# EAGLE design BMS Adapter Segment (EAGLE 8.1.0)
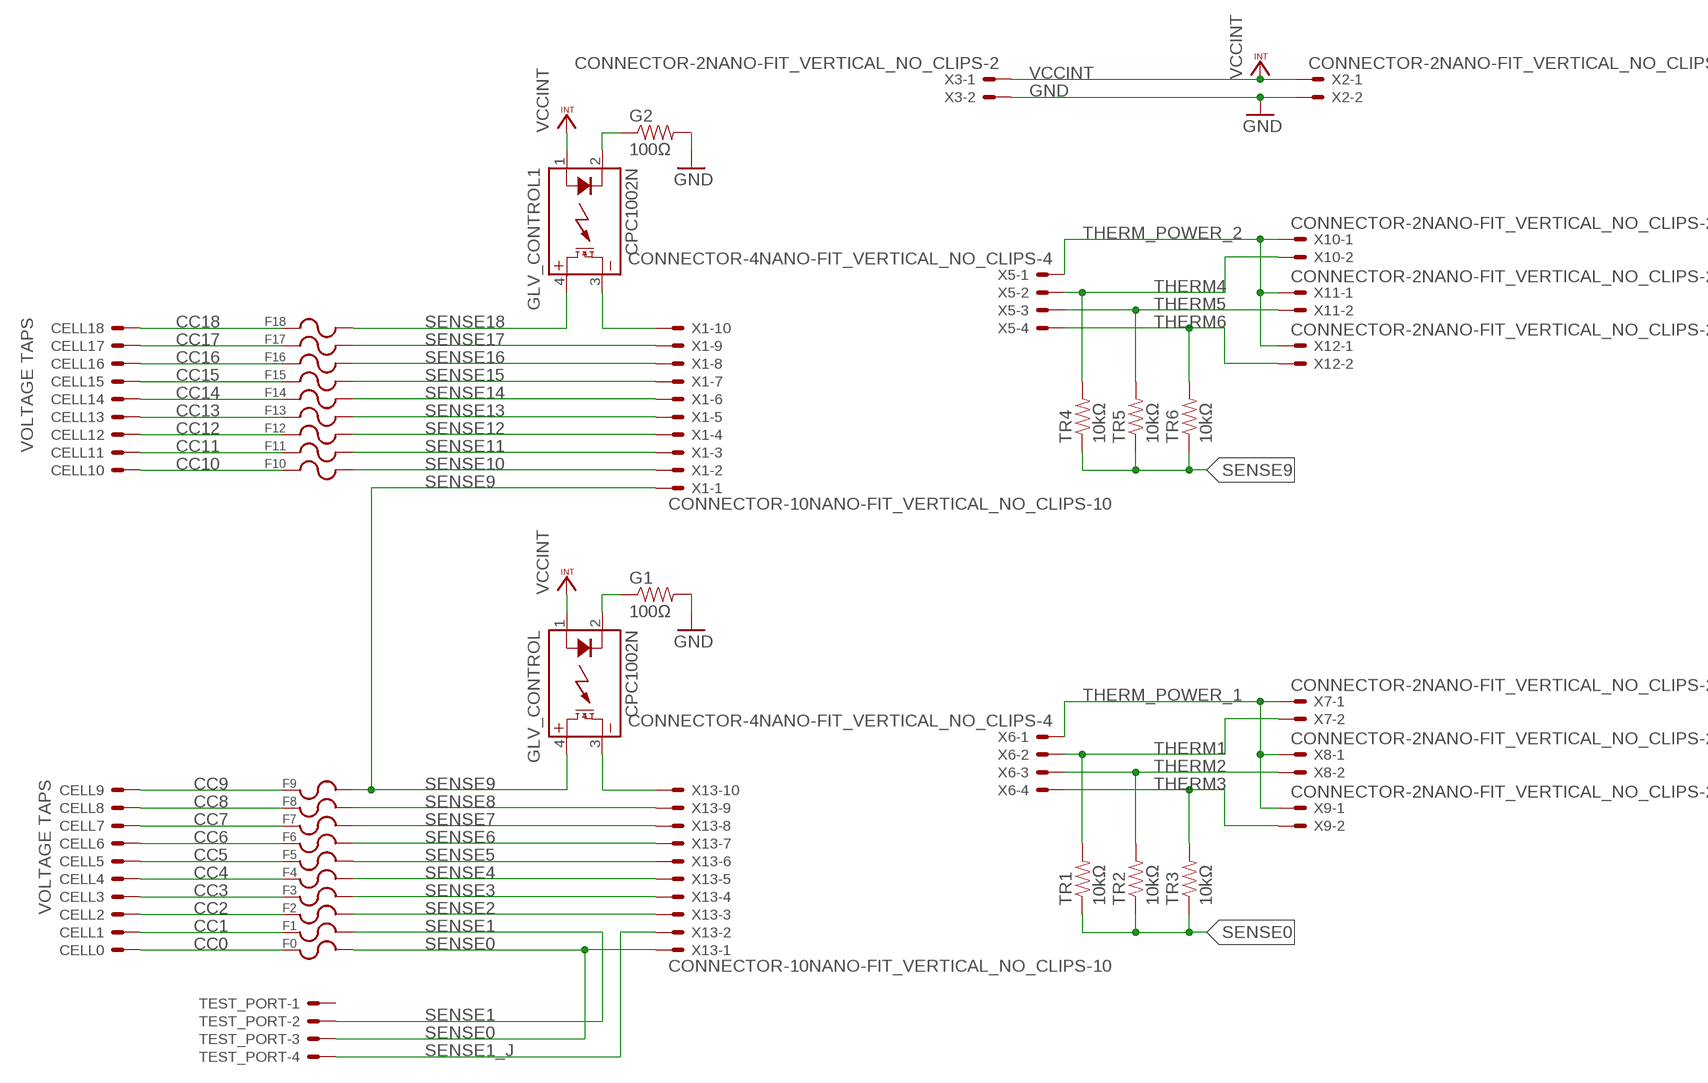
[diagram p0: schematic, sheet 1]

## Parts
CELL0  BATTERY_SPRING_KEYSTONE5222  [KEYSTONE5222]
CELL1  BATTERY_SPRING_KEYSTONE5222  [KEYSTONE5222]
CELL2  BATTERY_SPRING_KEYSTONE5222  [KEYSTONE5222]
CELL3  BATTERY_SPRING_KEYSTONE5222  [KEYSTONE5222]
CELL4  BATTERY_SPRING_KEYSTONE5222  [KEYSTONE5222]
CELL5  BATTERY_SPRING_KEYSTONE5222  [KEYSTONE5222]
CELL6  BATTERY_SPRING_KEYSTONE5222  [KEYSTONE5222]
CELL7  BATTERY_SPRING_KEYSTONE5222  [KEYSTONE5222]
CELL8  BATTERY_SPRING_KEYSTONE5222  [KEYSTONE5222]
CELL9  BATTERY_SPRING_KEYSTONE5222  [KEYSTONE5222]
CELL10  BATTERY_SPRING_KEYSTONE5222  [KEYSTONE5222]
CELL11  BATTERY_SPRING_KEYSTONE5222  [KEYSTONE5222]
CELL12  BATTERY_SPRING_KEYSTONE5222  [KEYSTONE5222]
CELL13  BATTERY_SPRING_KEYSTONE5222  [KEYSTONE5222]
CELL14  BATTERY_SPRING_KEYSTONE5222  [KEYSTONE5222]
CELL15  BATTERY_SPRING_KEYSTONE5222  [KEYSTONE5222]
CELL16  BATTERY_SPRING_KEYSTONE5222  [KEYSTONE5222]
CELL17  BATTERY_SPRING_KEYSTONE5222  [KEYSTONE5222]
CELL18  BATTERY_SPRING_KEYSTONE5222  [KEYSTONE5222]
F0  0751.0110_FUSE_CLIP  [0751.0110]
F1  0751.0110_FUSE_CLIP  [0751.0110]
F2  0751.0110_FUSE_CLIP  [0751.0110]
F3  0751.0110_FUSE_CLIP  [0751.0110]
F4  0751.0110_FUSE_CLIP  [0751.0110]
F5  0751.0110_FUSE_CLIP  [0751.0110]
F6  0751.0110_FUSE_CLIP  [0751.0110]
F7  0751.0110_FUSE_CLIP  [0751.0110]
F8  0751.0110_FUSE_CLIP  [0751.0110]
F9  0751.0110_FUSE_CLIP  [0751.0110]
F10  0751.0110_FUSE_CLIP  [0751.0110]
F11  0751.0110_FUSE_CLIP  [0751.0110]
F12  0751.0110_FUSE_CLIP  [0751.0110]
F13  0751.0110_FUSE_CLIP  [0751.0110]
F14  0751.0110_FUSE_CLIP  [0751.0110]
F15  0751.0110_FUSE_CLIP  [0751.0110]
F16  0751.0110_FUSE_CLIP  [0751.0110]
F17  0751.0110_FUSE_CLIP  [0751.0110]
F18  0751.0110_FUSE_CLIP  [0751.0110]
G1  100Ω  RESISTOR0805-RES  [0805]
G2  100Ω  RESISTOR0805-RES  [0805]
GLV_CONTROL  CPC1002N  [SOP04]
GLV_CONTROL1  CPC1002N  [SOP04]
TEST_PORT  MINIFIT_5566-4  [MINIFIT_5566-4]
TR1  10kΩ  RESISTOR0805-RES  [0805]
TR2  10kΩ  RESISTOR0805-RES  [0805]
TR3  10kΩ  RESISTOR0805-RES  [0805]
TR4  10kΩ  RESISTOR0805-RES  [0805]
TR5  10kΩ  RESISTOR0805-RES  [0805]
TR6  10kΩ  RESISTOR0805-RES  [0805]
X1  CONNECTOR-10NANO-FIT_VERTICAL_NO_CLIPS-10  [NANO-FIT_VERTICAL_NO_CLIPS-10]
X2  CONNECTOR-2NANO-FIT_VERTICAL_NO_CLIPS-2  [NANO-FIT_VERTICAL_NO_CLIPS-2]
X3  CONNECTOR-2NANO-FIT_VERTICAL_NO_CLIPS-2  [NANO-FIT_VERTICAL_NO_CLIPS-2]
X5  CONNECTOR-4NANO-FIT_VERTICAL_NO_CLIPS-4  [NANO-FIT_VERTICAL_NO_CLIPS-4]
X6  CONNECTOR-4NANO-FIT_VERTICAL_NO_CLIPS-4  [NANO-FIT_VERTICAL_NO_CLIPS-4]
X7  CONNECTOR-2NANO-FIT_VERTICAL_NO_CLIPS-2  [NANO-FIT_VERTICAL_NO_CLIPS-2]
X8  CONNECTOR-2NANO-FIT_VERTICAL_NO_CLIPS-2  [NANO-FIT_VERTICAL_NO_CLIPS-2]
X9  CONNECTOR-2NANO-FIT_VERTICAL_NO_CLIPS-2  [NANO-FIT_VERTICAL_NO_CLIPS-2]
X10  CONNECTOR-2NANO-FIT_VERTICAL_NO_CLIPS-2  [NANO-FIT_VERTICAL_NO_CLIPS-2]
X11  CONNECTOR-2NANO-FIT_VERTICAL_NO_CLIPS-2  [NANO-FIT_VERTICAL_NO_CLIPS-2]
X12  CONNECTOR-2NANO-FIT_VERTICAL_NO_CLIPS-2  [NANO-FIT_VERTICAL_NO_CLIPS-2]
X13  CONNECTOR-10NANO-FIT_VERTICAL_NO_CLIPS-10  [NANO-FIT_VERTICAL_NO_CLIPS-10]

## Nets
CC0: CELL0.P$1(S) F0.L1 F0.L2
CC1: CELL1.P$1(S) F1.L1 F1.L2
CC2: CELL2.P$1(S) F2.L1 F2.L2
CC3: CELL3.P$1(S) F3.L1 F3.L2
CC4: CELL4.P$1(S) F4.L1 F4.L2
CC5: CELL5.P$1(S) F5.L1 F5.L2
CC6: CELL6.P$1(S) F6.L1 F6.L2
CC7: CELL7.P$1(S) F7.L1 F7.L2
CC8: CELL8.P$1(S) F8.L1 F8.L2
CC9: CELL9.P$1(S) F9.L1 F9.L2
CC10: CELL10.P$1(S) F10.L1 F10.L2
CC11: CELL11.P$1(S) F11.L1 F11.L2
CC12: CELL12.P$1(S) F12.L1 F12.L2
CC13: CELL13.P$1(S) F13.L1 F13.L2
CC14: CELL14.P$1(S) F14.L1 F14.L2
CC15: CELL15.P$1(S) F15.L1 F15.L2
CC16: CELL16.P$1(S) F16.L1 F16.L2
CC17: CELL17.P$1(S) F17.L1 F17.L2
CC18: CELL18.P$1(S) F18.L1 F18.L2
GND: G1.2 G2.2 X2.P$2 X3.P$2
N$2: GLV_CONTROL1.3(DC-) X1.P$10
N$3: GLV_CONTROL.3(DC-) X13.P$10
SENSE0: F0.R1 F0.R2 TEST_PORT.3 TR1.1 TR2.1 TR3.1 X13.P$1
SENSE1: F1.R1 F1.R2 TEST_PORT.2
SENSE1_J: TEST_PORT.4 X13.P$2
SENSE2: F2.R1 F2.R2 X13.P$3
SENSE3: F3.R1 F3.R2 X13.P$4
SENSE4: F4.R1 F4.R2 X13.P$5
SENSE5: F5.R1 F5.R2 X13.P$6
SENSE6: F6.R1 F6.R2 X13.P$7
SENSE7: F7.R1 F7.R2 X13.P$8
SENSE8: F8.R1 F8.R2 X13.P$9
SENSE9: F9.R1 F9.R2 GLV_CONTROL.4(DC+) TR4.1 TR5.1 TR6.1 X1.P$1
SENSE10: F10.R1 F10.R2 X1.P$2
SENSE11: F11.R1 F11.R2 X1.P$3
SENSE12: F12.R1 F12.R2 X1.P$4
SENSE13: F13.R1 F13.R2 X1.P$5
SENSE14: F14.R1 F14.R2 X1.P$6
SENSE15: F15.R1 F15.R2 X1.P$7
SENSE16: F16.R1 F16.R2 X1.P$8
SENSE17: F17.R1 F17.R2 X1.P$9
SENSE18: F18.R1 F18.R2 GLV_CONTROL1.4(DC+)
SSR-: G1.1 GLV_CONTROL.2(CONTROL-)
SSR-1: G2.1 GLV_CONTROL1.2(CONTROL-)
THERM1: TR1.2 X6.P$2 X7.P$2
THERM2: TR2.2 X6.P$3 X8.P$2
THERM3: TR3.2 X6.P$4 X9.P$2
THERM4: TR4.2 X5.P$2 X10.P$2
THERM5: TR5.2 X5.P$3 X11.P$2
THERM6: TR6.2 X5.P$4 X12.P$2
THERM_POWER_1: X6.P$1 X7.P$1 X8.P$1 X9.P$1
THERM_POWER_2: X5.P$1 X10.P$1 X11.P$1 X12.P$1
VCCINT: GLV_CONTROL1.1(CONTROL+) GLV_CONTROL.1(CONTROL+) X2.P$1 X3.P$1
Unconnected: TEST_PORT.1

## Notes on the sheet
- VOLTAGE TAPS
- VOLTAGE TAPS

## Library data of the parts
CELL0 CELL1-CELL18 = HyTechDevices:BATTERY_SPRING
F0 F1-F18 = HyTechDevices:0751.0110_FUSE_CLIP: Schurter 0751.0110 Brass Fuse Clip Datasheet <http://www.mouser.com/ds/2/358/typ_OG__Clip__5x20-2553.pdf>
G1 G2 TR1-TR6 = HyTechDevices:RESISTOR: Resistor Basic schematic elements and footprints for 0603, 1206, and PTH resistors.
GLV_CONTROL GLV_CONTROL1 = HyTechDevices:CPC1002N: IXYS Solid State Relay .7A
TEST_PORT = HyTechDevices:MINIFIT_5566-4: Mini-Fit Junior connector 4 pole Source: http://www.molex.com; OC_FARNELL: unknown; OC_NEWARK: unknown
X1 X13 = HyTechDevices:CONNECTOR-10: Mini-Fit Junior connector 10 pole Source: http://www.molex.com
X2 X3 X7-X12 = HyTechDevices:CONNECTOR-2: Mini-Fit Junior connector 2 pole Source: http://www.molex.com
X5 X6 = HyTechDevices:CONNECTOR-4: Mini-Fit Junior connector 4 pole Source: http://www.molex.com

## Board
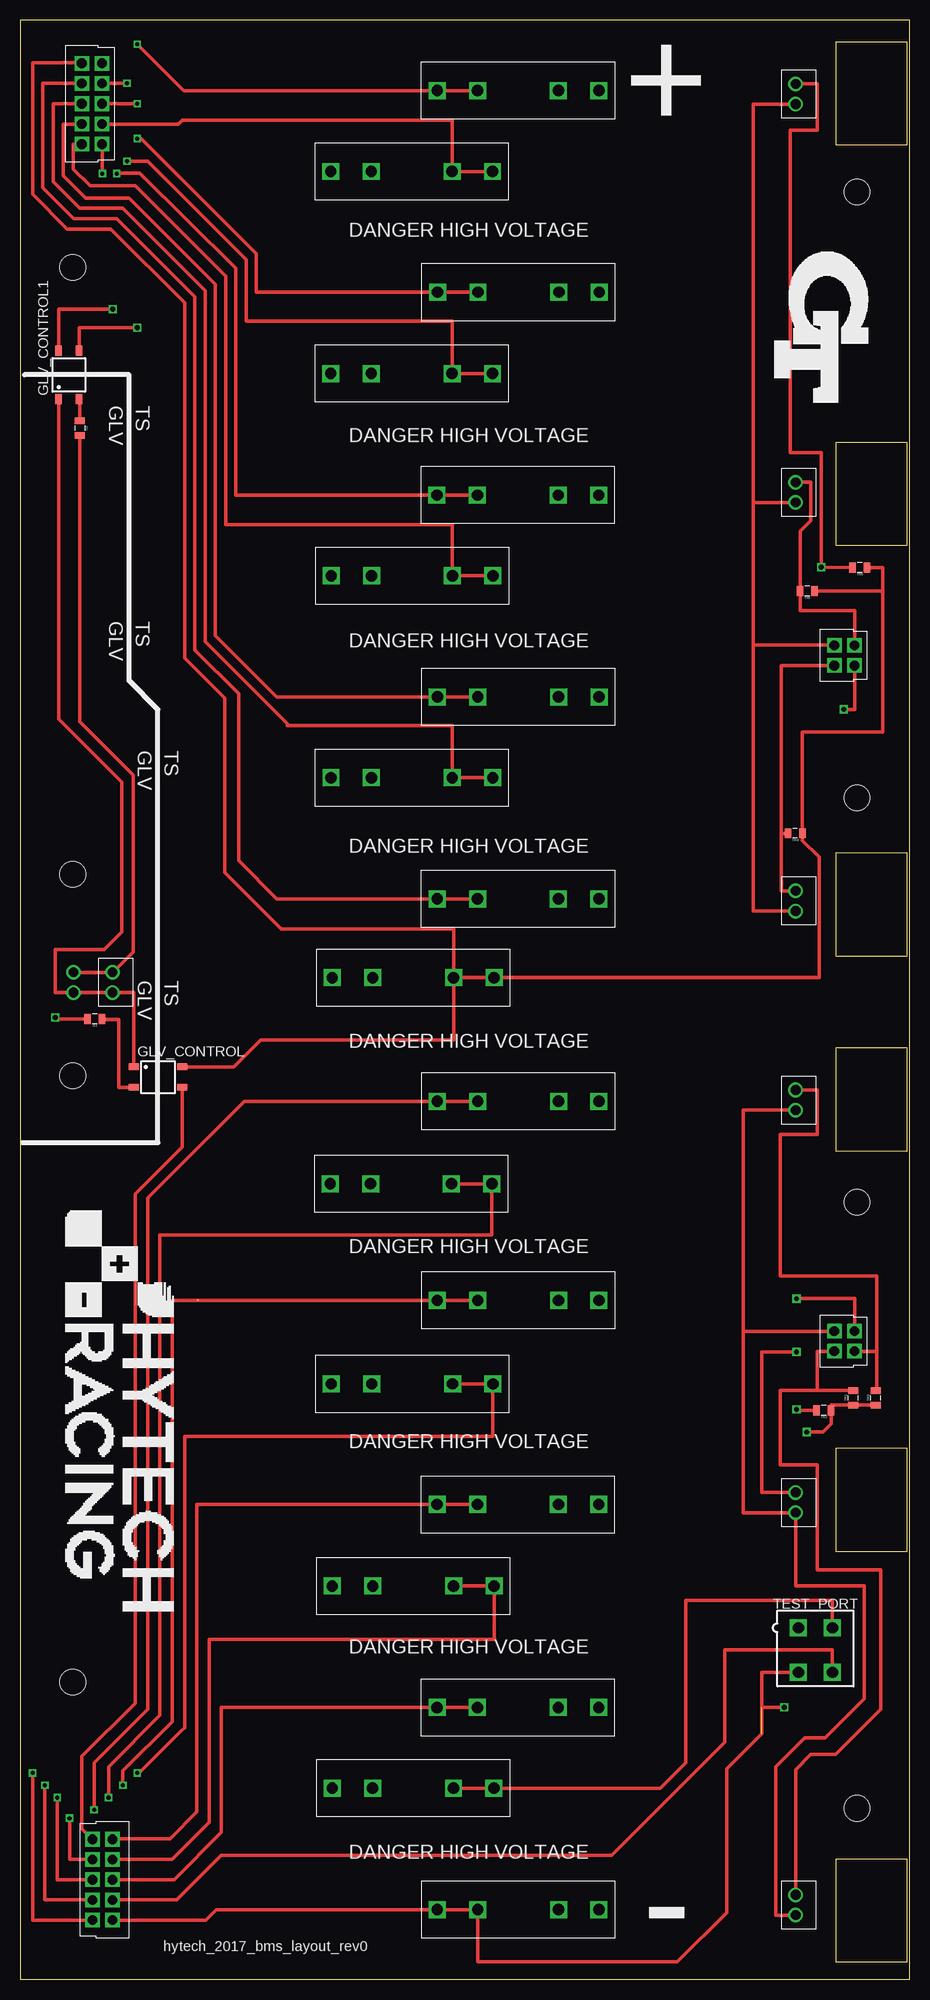
[diagram p1: board, top side]
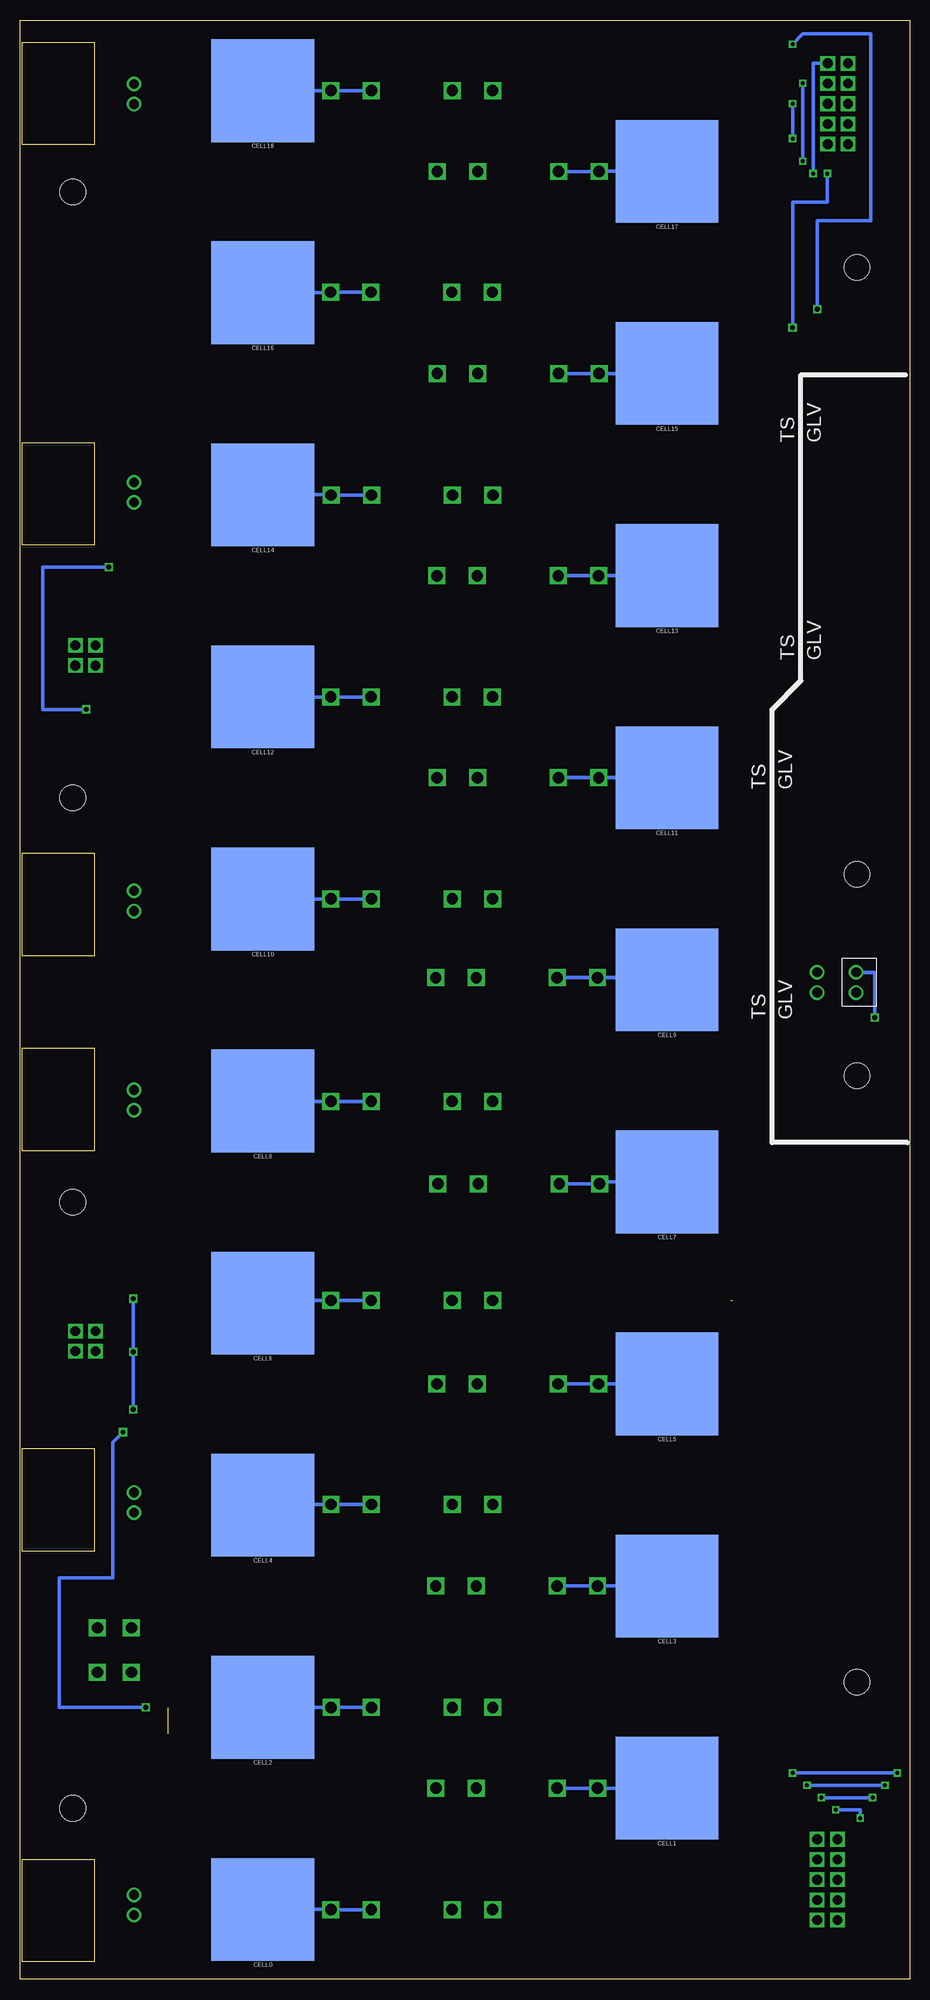
[diagram p2: board, bottom side, seen from below]

Size 110 x 242.36 mm. Coordinates in mm from the lower left corner, seen from the top.
Outline: 0,0 110,0 110,242.36 0,242.36 0,0
Outline: 109.73,239.65 100.84,239.65 100.84,226.95 109.73,226.95 109.73,239.65
Outline: 109.73,190.12 100.84,190.12 100.84,177.42 109.73,177.42 109.73,190.12
Outline: 109.73,139.32 100.84,139.32 100.84,126.62 109.73,126.62 109.73,139.32
Outline: 109.73,115.19 100.84,115.19 100.84,102.49 109.73,102.49 109.73,115.19
Outline: 109.73,65.66 100.84,65.66 100.84,52.96 109.73,52.96 109.73,65.66
Outline: 109.73,14.86 100.84,14.86 100.84,2.16 109.73,2.16 109.73,14.86
Copper layers (1*16): Top 0.035mm / dielectric 1.5mm / Bottom 0.035mm
Design rules "default": minimum track width 10mil, minimum drill 24mil, track to track 8mil, track to pad 8mil, pad to pad 8mil, via to via 8mil, smd to smd 8mil, copper to edge 40mil, drill to drill 8mil, minimum pad ring 10mil, minimum via ring 8mil, stop-mask expansion 4mil, vias tented up to drill 0mil, thermal gap 10mil
Holes 3.2 mm at 6.5,36.77 6.5,111.77 103.5,96.15 103.5,21.15 6.5,136.71 6.49,211.77 103.5,146.15 103.5,221.12

### Footprints (pad centres in the part's own frame; a part is rotated, then mirrored left to right if it is on the bottom)
KEYSTONE5222 = smd 12.7 x 12.7: P$1 0,0
0751.0110 = drill 1.4 square: L1 -10,0; L2 -5,0; R1 5,0; R2 10,0
0805 = smd 0.8 x 1.2: 1 -0.9,0; 2 0.9,0
SOP04 = smd 0.8 x 1.2: 1 -1.27,-3; 2 1.27,-3; 3 1.27,3; 4 -1.27,3
MINIFIT_5566-4 = drill 1.4 square: 1 2.1,-2.75; 2 -2.1,-2.75; 3 2.1,2.75; 4 -2.1,2.75
NANO-FIT_VERTICAL_NO_CLIPS-10 = drill 1.2 square: P$1 -5,0; P$2 -2.5,0; P$3 0,0; P$4 2.5,0; P$5 5,0; P$6 -5,2.5; P$7 -2.5,2.5; P$8 0,2.5; P$9 2.5,2.5; P$10 5,2.5
NANO-FIT_VERTICAL_NO_CLIPS-2 = drill 1.2: P$1 -1.25,0; P$2 1.25,0
NANO-FIT_VERTICAL_NO_CLIPS-4 = drill 1.2 square: P$1 -1.25,0; P$2 1.25,0; P$3 -1.25,2.5; P$4 1.25,2.5

### Placement (x,y rotation side)
CELL0  80,8.65 0 bottom
CELL1  30,23.65 0 bottom
CELL2  80,33.65 0 bottom
CELL3  30,48.65 0 bottom
CELL4  80,58.65 0 bottom
CELL5  30,73.65 0 bottom
CELL6  80,83.65 0 bottom
CELL7  30,98.65 0 bottom
CELL8  80,108.65 0 bottom
CELL9  30,123.65 0 bottom
CELL10  80,133.65 0 bottom
CELL11  30,148.65 0 bottom
CELL12  80,158.65 0 bottom
CELL13  30,173.65 0 bottom
CELL14  80,183.65 0 bottom
CELL15  30,198.65 0 bottom
CELL16  80,208.65 0 bottom
CELL17  30,223.65 0 bottom
CELL18  80,233.65 0 bottom
F0  61.58,8.63 180 top
F1  48.59,23.65 0 top
F2  61.56,33.62 180 top
F3  48.6,48.65 0 top
F4  61.56,58.74 180 top
F5  48.47,73.66 0 top
F6  61.58,83.99 180 top
F7  48.34,98.41 0 top
F8  61.58,108.61 180 top
F9  48.6,123.91 0 top
F10  61.57,133.66 180 top
F11  48.44,148.64 0 top
F12  61.59,158.65 180 top
F13  48.46,173.64 0 top
F14  61.54,183.62 180 top
F15  48.41,198.66 0 top
F16  61.62,208.71 180 top
F17  48.41,223.65 0 top
F18  61.57,233.66 180 top
G1  9.24,118.81 180 top
G2  7.37,191.9 270 top
GLV_CONTROL  17.05,111.6 270 top
GLV_CONTROL1  6.02,198.48 0 top
TEST_PORT  98.35,40.73 180 top
TR1  103.02,71.94 90 top
TR2  99.39,70.39 180 top
TR3  105.82,71.94 90 top
TR4  95.83,141.76 180 top
TR5  97.36,171.73 180 top
TR6  103.84,174.65 180 top
X1  7.62,232.03 270 top
X2  6.6,123.32 90 bottom
X3  11.43,123.32 90 top
X5  100.69,163.78 270 top
X6  100.69,78.95 270 top
X7  95.91,9.2 90 top
X8  95.91,58.98 90 top
X9  95.91,108.77 90 top
X10  95.91,133.4 90 top
X11  95.91,183.95 90 top
X12  95.91,233.23 90 top
X13  11.43,12.32 90 top

### Tracks (layer width: path | path; a pad name or v marks a point on that pad's centre or on a via)
CC0
  Bottom 0.406: CELL0.P$1 71.55,8.65 F0.L1 F0.L2
CC1
  Bottom 0.406: CELL1.P$1 F1.L1 F1.L2
CC2
  Bottom 0.406: F2.L2 F2.L1 | F2.L1 72.1,33.62 72.14,33.66 71.57,33.66 F2.L1 | F2.L1 79.97,33.62 CELL2.P$1
CC3
  Bottom 0.406: CELL3.P$1 F3.L1 F3.L2
CC4
  Bottom 0.406: F4.L2 F4.L1 79.91,58.74 CELL4.P$1
CC5
  Bottom 0.406: CELL5.P$1 38.35,73.65 F5.L1 F5.L2
CC6
  Bottom 0.406: F6.L2 F6.L1 79.66,83.99 CELL6.P$1
CC7
  Bottom 0.406: CELL7.P$1 38.1,98.65 F7.L1 F7.L2
CC8
  Bottom 0.406: F8.L2 F8.L1 79.97,108.61 CELL8.P$1
CC9
  Bottom 0.406: F9.L2 F9.L1 30.26,123.91 CELL9.P$1
CC10
  Bottom 0.406: CELL10.P$1 71.54,133.65 F10.L1 F10.L2
CC11
  Bottom 0.406: CELL11.P$1 F11.L1 F11.L2
CC12
  Bottom 0.406: CELL12.P$1 71.52,158.65 F12.L1 F12.L2
CC13
  Bottom 0.406: CELL13.P$1 38.46,173.65 F13.L1 F13.L2
CC14
  Bottom 0.406: F14.L2 F14.L1 71.54,183.65 CELL14.P$1
CC15
  Bottom 0.406: F15.L2 F15.L1 CELL15.P$1
CC16
  Bottom 0.406: CELL16.P$1 71.62,208.65 F16.L1 F16.L2
CC17
  Bottom 0.406: CELL17.P$1 F17.L1 F17.L2
CC18
  Bottom 0.406: CELL18.P$1 F18.L1 F18.L2
GND  (via drill 0.6)
  Top 0.406: X2.P$2 X3.P$2 13.97,127.11 13.97,148.97 7.37,155.58 G2.2 | G1.2 4.32,118.81 v4.32,119
  Bottom 0.406: v4.32,119 4.32,124.57 X2.P$2
N$2  (via drill 0.5, 0.6)
  Top 0.406: v14.48,204.35 7.29,204.35 GLV_CONTROL1.3 | v10.16,223.4 10.16,226.99 X1.P$10
  Bottom 0.406: v10.16,223.4 10.16,219.84 14.48,219.84 v14.48,204.35
N$3
  Top 0.406: GLV_CONTROL.3 20.05,102.98 14.22,97.16 14.22,34.17 7.62,27.56 7.62,18.63 X13.P$10
SENSE0  (via drill 0.6)  (1 unrouted)
  Top 0.406: TEST_PORT.3 91.69,37.98 91.69,30.36 87.38,26.04 87.38,8.26 81.28,2.16 56.58,2.16 F0.R1 F0.R2 24.25,8.63 22.94,7.32 X13.P$1 | 91.69,33.91 91.69,33.66 v94.49,33.66 | TR3.1 TR1.1 100.29,71.04 TR2.1 100.33,70.35 100.33,68.71 99.31,67.69 v97.28,67.69
  Bottom 0.406: v94.49,33.66 105.16,33.66 105.16,49.66 98.55,49.66 98.55,66.42 v97.28,67.69
SENSE1
  Top 0.406: F1.R1 F1.R2 79.15,23.65 82.3,26.8 82.3,46.87 100.45,46.87 TEST_PORT.2
SENSE1_J
  Top 0.406: TEST_PORT.4 100.45,40.77 87.12,40.77 87.12,29.34 73.15,15.37 24.89,15.37 19.34,9.82 X13.P$2
SENSE2
  Top 0.406: F2.R1 F2.R2 24.89,33.62 24.89,18.16 19.05,12.32 X13.P$3
SENSE3
  Top 0.406: F3.R1 F3.R2 58.6,42.04 23.37,42.04 23.37,19.43 18.8,14.86 11.47,14.86 X13.P$4
SENSE4
  Top 0.406: 56.41,58.53 F4.R1 F4.R2 21.84,58.74 21.84,20.7 18.54,17.4 11.51,17.4 X13.P$5
SENSE5  (via drill 0.5)
  Top 0.406: 53.34,73.4 F5.R1 F5.R2 58.47,67.19 20.32,67.19 20.32,31.12 19.94,30.75 14.72,25.53 v14.48,25.53 | v1.52,25.53 1.52,7.32 X13.P$6
  Bottom 0.406: v14.48,25.53 v1.52,25.53
SENSE6  (via drill 0.5)  (1 unrouted)
  Top 0.406: F6.R1 F6.R2 21.84,83.99 | 22.1,83.99 18.8,83.99 18.8,31.88 12.7,25.78 v12.7,24.01 | v3.05,24.01 3.05,9.82 X13.P$7
  Bottom 0.406: v12.7,24.01 v3.05,24.01
SENSE7  (via drill 0.5)
  Top 0.406: F7.R1 F7.R2 58.34,92.08 17.27,92.08 17.27,32.64 10.92,26.29 v10.92,22.48 | v4.57,22.48 4.57,12.32 X13.P$8
  Bottom 0.406: v10.92,22.48 v4.57,22.48
SENSE8  (via drill 0.5)
  Top 0.406: F8.R1 F8.R2 27.71,108.61 15.75,96.65 15.75,33.4 9.14,26.8 v9.14,20.96 | v6.1,19.94 6.1,14.82 X13.P$9
  Bottom 0.406: v6.1,19.94 6.1,20.96 v9.14,20.96
SENSE9
  Top 0.406: F9.R1 F9.R2 98.81,123.91 98.81,138.81 96.73,140.89 TR4.1 96.73,154.31 106.68,154.31 106.68,171.73 | F9.R1 53.6,116.21 29.73,116.21 26.4,112.87 GLV_CONTROL.4 | F9.R1 53.6,129.92 32.26,129.92 25.27,136.91 25.27,158.5 20.32,163.45 20.32,207.39 11.18,216.54 5.84,216.54 1.52,220.86 1.52,237.11 7.62,237.11 X1.P$1 | 106.68,171.73 TR5.1 | TR6.1 106.68,174.65 106.68,171.73
SENSE10
  Top 0.406: F10.R1 F10.R2 31.75,133.66 27.01,138.39 27.01,159.04 21.59,164.47 21.59,208.16 11.94,217.81 6.6,217.81 2.79,221.62 2.79,234.57 7.62,234.57 X1.P$2
SENSE11
  Top 0.406: F11.R2 F11.R1 53.44,155.07 33.02,155.07 33.02,155.32 22.86,165.48 22.86,208.92 12.7,219.08 7.37,219.08 4.06,222.38 4.06,232.03 X1.P$3
SENSE12
  Top 0.406: F12.R1 F12.R2 31.73,158.65 24.13,166.25 24.13,209.68 13.46,220.35 8.13,220.35 5.33,223.14 5.33,229.49 7.62,229.49 X1.P$4
SENSE13
  Top 0.406: F13.R2 F13.R1 53.46,179.96 25.4,179.96 25.4,210.7 14.22,221.87 8.64,221.87 6.55,223.95 6.55,227.03 X1.P$5
SENSE14  (via drill 0.5)
  Top 0.406: F14.R1 F14.R2 26.67,183.62 26.67,211.71 14.75,223.42 12.21,223.42 v11.94,223.4
  Bottom 0.406: X1.P$6 11.94,237.03 v11.94,223.4
SENSE15  (via drill 0.5)
  Top 0.406: F15.R2 F15.R1 53.41,205.11 27.94,205.11 27.94,212.73 15.75,224.92 v13.21,224.92 | v13.21,234.57 10.16,234.57 X1.P$7
  Bottom 0.406: v13.21,224.92 v13.21,234.57
SENSE16  (via drill 0.5)
  Top 0.406: F16.R1 F16.R2 29.21,208.71 29.21,213.49 14.99,227.71 v14.48,227.71 | X1.P$8 v14.48,232.03
  Bottom 0.406: v14.48,232.03 v14.48,227.71
SENSE17
  Top 0.406: F17.R2 F17.R1 53.41,230 20.07,230 19.56,229.49 10.16,229.49 X1.P$9
SENSE18  (via drill 0.5, 0.6)
  Top 0.406: F18.R1 F18.R2 20.22,233.66 v14.48,239.4 | v11.43,206.63 4.75,206.63 GLV_CONTROL1.4
  Bottom 0.406: v11.43,206.63 11.43,217.55 4.83,217.55 4.83,240.67 13.21,240.67 v14.48,239.4
SSR-
  Top 0.406: GLV_CONTROL.2 12.19,110.33 12.19,118.75 10.14,118.75 G1.1
SSR-1
  Top 0.406: GLV_CONTROL1.2 7.37,195.48 G2.1
THERM1
  Top 0.406: X7.P$2 95.91,25.94 97.79,27.82 100.84,27.82 106.43,33.4 106.43,50.68 98.55,50.68 98.55,63.63 93.98,63.63 93.98,72.84 98.55,72.84 | X6.P$2 98.55,77.7 98.55,72.84 | TR1.2 98.55,72.84
THERM2  (via drill 0.6)
  Top 0.406: X6.P$3 103.19,84.2 v96.01,84.2 | TR2.2 96.01,70.39 v96.01,70.49 | X8.P$2 91.69,60.23 91.69,77.6 v96.01,77.6
  Bottom 0.406: v96.01,84.2 v96.01,77.6 v96.01,70.49
THERM3
  Top 0.406: X9.P$2 98.55,110.02 98.55,104.52 93.98,104.52 93.98,87 105.92,87 105.92,77.7 | 105.92,77.7 X6.P$4 | 105.92,77.7 105.92,72.84 TR3.2
THERM4
  Top 0.406: X5.P$2 94.13,162.53 94.13,141.76 | X10.P$2 94.13,134.65 94.13,141.76 | TR4.2 94.13,141.76
THERM5
  Top 0.406: X5.P$3 103.19,169.29 96.46,169.29 TR5.2 96.46,179.14 97.79,180.47 97.79,185.2 X11.P$2
THERM6  (via drill 0.6)
  Top 0.406: X12.P$2 98.55,234.48 98.55,228.73 95.25,228.73 95.25,188.85 99.06,188.85 v99.06,174.69 TR6.2 | v101.85,157.1 103.19,157.1 X5.P$4
  Bottom 0.406: v99.06,174.69 107.19,174.69 107.19,157.1 v101.85,157.1
THERM_POWER_1
  Top 0.406: X9.P$1 89.41,107.52 89.41,80.14 | 89.41,80.14 89.41,57.73 X8.P$1 95.91,48.64 104.39,48.64 104.39,34.67 99.57,29.85 97.03,29.85 93.47,26.29 93.47,7.95 X7.P$1 | X6.P$1 100.69,80.14 89.41,80.14
THERM_POWER_2
  Top 0.406: X12.P$1 90.68,231.98 90.68,182.7 | 90.68,182.7 X11.P$1 | X10.P$1 90.68,132.15 90.68,165.03 | 90.68,165.03 90.68,182.7 | X5.P$1 90.68,165.03
VCCINT
  Top 0.406: GLV_CONTROL1.1 4.75,155.91 12.57,148.08 12.57,129.54 10.41,127.38 4.32,127.38 4.32,122.05 6.58,122.05 X2.P$1 X3.P$1 14.05,122.07 GLV_CONTROL.1

### Text on the board
tPlace: + | DANGER HIGH VOLTAGE | GLV | TS | DANGER HIGH VOLTAGE | GLV | TS | DANGER HIGH VOLTAGE | GLV | TS | DANGER HIGH VOLTAGE | GLV | TS | DANGER HIGH VOLTAGE | DANGER HIGH VOLTAGE | DANGER HIGH VOLTAGE | DANGER HIGH VOLTAGE | DANGER HIGH VOLTAGE | hytech_2017_bms_layout_rev0 | -
bPlace: GLV | TS | GLV | TS | GLV | TS | GLV | TS